# EAGLE design mass_measurement (EAGLE 9.6.2)
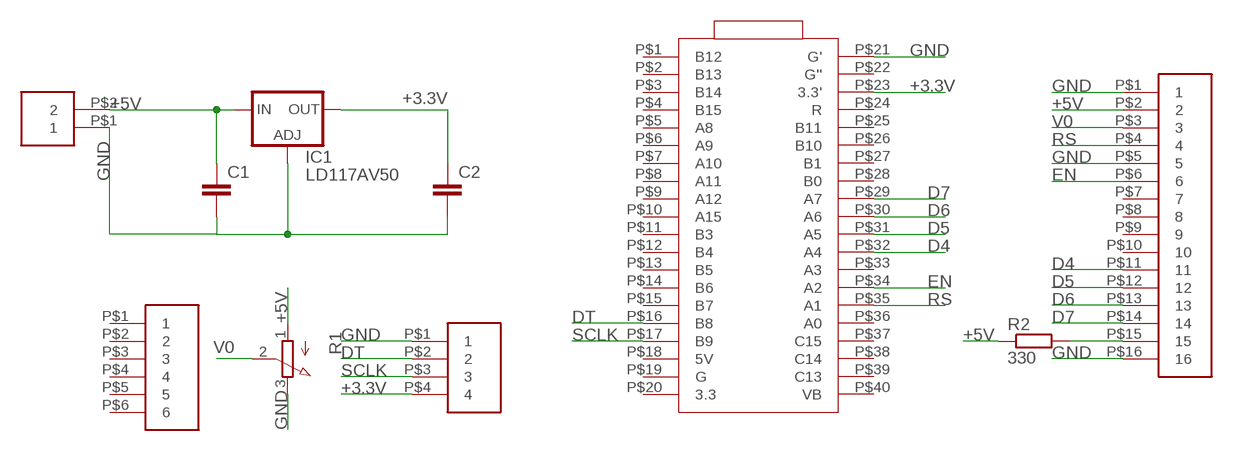
[diagram p0: schematic, sheet 1]

## Parts
C1  C-EU025-030X050  [C025-030X050]
C2  C-EU025-030X050  [C025-030X050]
IC1  LD117AV50  [TO220L1]
R1  3RP/1610N  [3RP/1610N]
R2  330  R-EU_0617/17  [0617/17]
U$1  HEADER_2  [HEADER_2_FOOT]
U$2  HEADER_16  [HEADER_16_FOOT]
U$3  BLUE_PILL_EA  [BLUE_PILL_FOOT]
U$4  HEADER_4  [HEADER_4_FOOT]
U$5  HEADER_6  [HEADER_6_FOOT]

## Nets
+3.3V: C2.1 IC1.2(OUT) U$3.P$23(3.3') U$4.P$4
+5V: C1.1 IC1.3(IN) R1.1(A) R2.1 U$1.P$2 U$2.P$2
D4: U$2.P$11 U$3.P$32(A4)
D5: U$2.P$12 U$3.P$31(A5)
D6: U$2.P$13 U$3.P$30(A6)
D7: U$2.P$14 U$3.P$29(A7)
DT: U$3.P$16(B8) U$4.P$2
EN: U$2.P$6 U$3.P$34(A2)
GND: C1.2 C2.2 IC1.1(ADJ) R1.3(E) U$1.P$1 U$2.P$1 U$2.P$5 U$2.P$16 U$3.P$21(G') U$4.P$1
N$1: R2.2 U$2.P$15
RS: U$2.P$4 U$3.P$35(A1)
SCLK: U$3.P$17(B9) U$4.P$3
V0: R1.2(S) U$2.P$3
Unconnected: U$2.P$7 U$2.P$8 U$2.P$9 U$2.P$10 U$3.P$1(B12) U$3.P$2(B13) U$3.P$3(B14) U$3.P$4(B15) U$3.P$5(A8) U$3.P$6(A9) U$3.P$7(A10) U$3.P$8(A11) U$3.P$9(A12) U$3.P$10(A15) U$3.P$11(B3) U$3.P$12(B4) U$3.P$13(B5) U$3.P$14(B6) U$3.P$15(B7) U$3.P$18(5V) U$3.P$19(G) U$3.P$20(3.3) U$3.P$22(G'') U$3.P$24(R) U$3.P$25(B11) U$3.P$26(B10) U$3.P$27(B1) U$3.P$28(B0) U$3.P$33(A3) U$3.P$36(A0) U$3.P$37(C15) U$3.P$38(C14) U$3.P$39(C13) U$3.P$40(VB) U$5.P$1 U$5.P$2 U$5.P$3 U$5.P$4 U$5.P$5 U$5.P$6

## Library data of the parts
C1 C2 = rcl:C-EU: CAPACITOR, European symbol; SPICEPREFIX: C
IC1 = v-reg:LD117A?*: Low drop fixed and adjustable positive voltage regulators 1 A Source: http://www.st.com/stonline/products/literature/ds/7194/ld1117axx.pdf
R1 = pot:3RP/1610N: 16mm Potentiometer one level Source: http://www.alphapotentiometers.net/html/16mm_pot_2.html
R2 = rcl:R-EU_: RESISTOR, European symbol; SPICEPREFIX: R
U$1 = header:HEADER_2
U$2 = header:HEADER_16
U$3 = blue_pill_ea:BLUE_PILL_EA
U$4 = header:HEADER_4
U$5 = header:HEADER_6

## Board
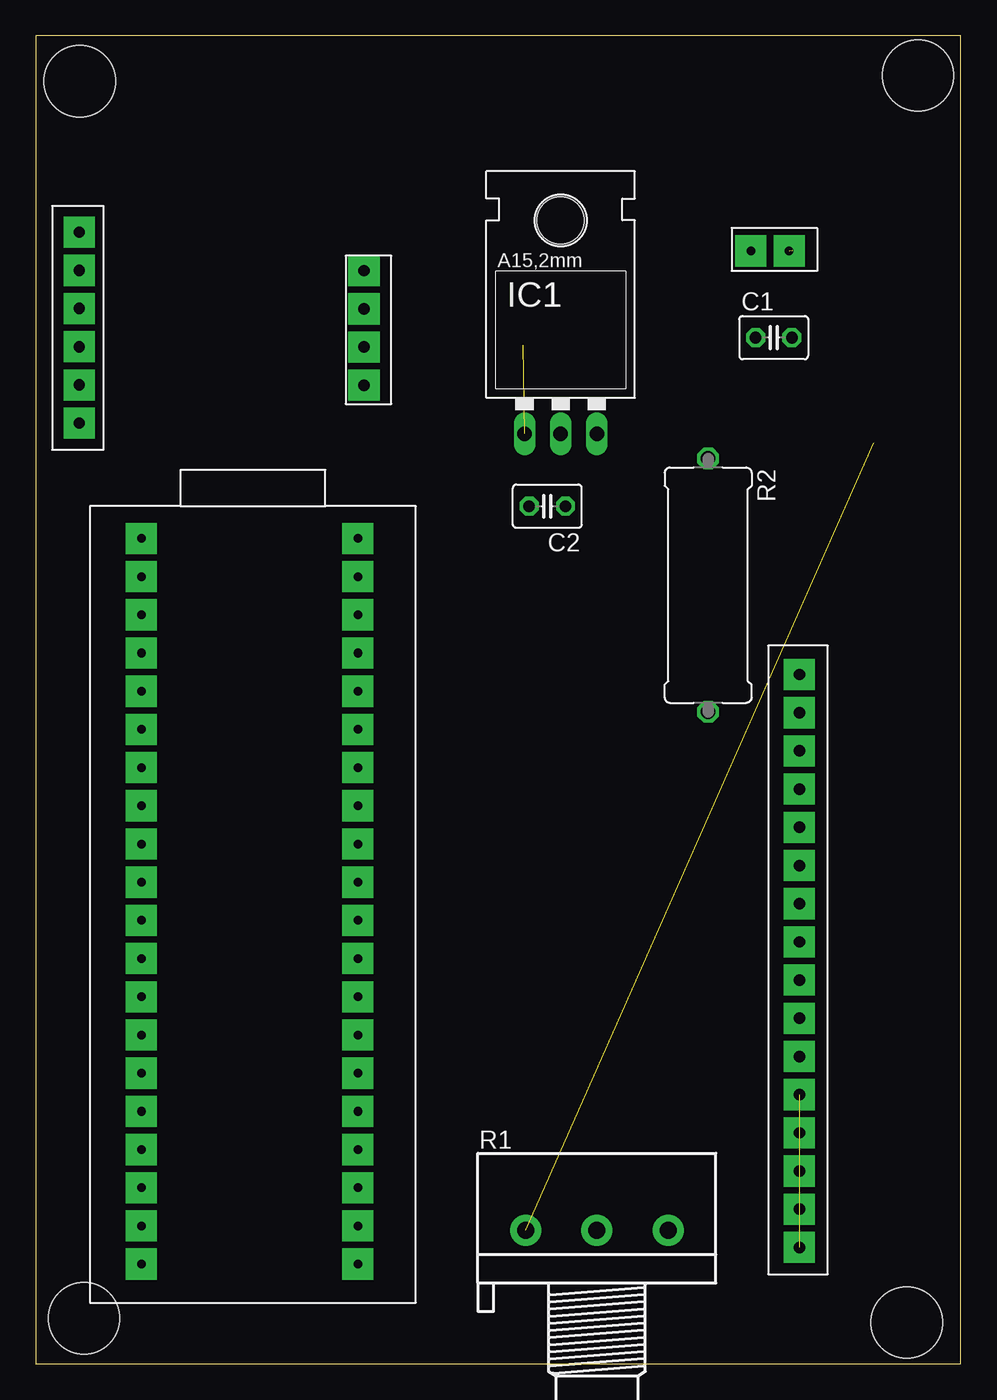
[diagram p1: board, top side]
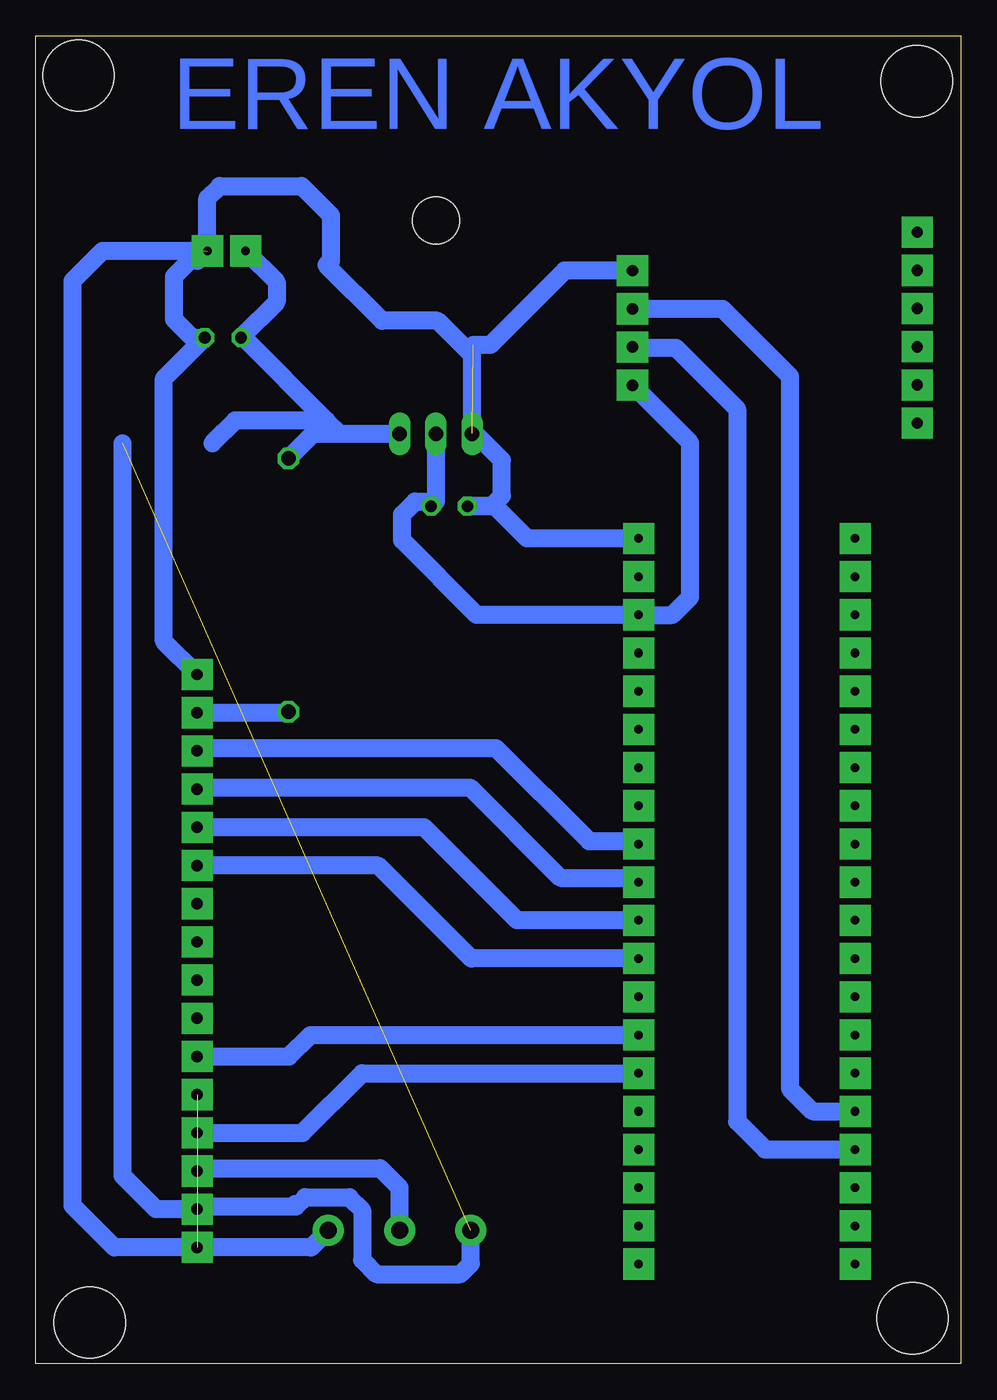
[diagram p2: board, bottom side, seen from below]

Size 64.9 x 93.2 mm. Coordinates in mm from the lower left corner, seen from the top.
Outline: 0,0 64.9,0 64.9,93.2 0,93.2 0,0
Copper layers (1*16): Top 0.035mm / dielectric 1.5mm / Bottom 0.035mm
Design rules "default": minimum track width 6mil, minimum drill 0.35mm, track to track 6mil, track to pad 6mil, pad to pad 6mil, via to via 6mil, smd to smd 6mil, copper to edge 40mil, drill to drill 6mil, minimum pad ring 10mil, minimum via ring 8mil, stop-mask expansion 4mil, vias tented up to drill 0mil, thermal gap 10mil
Holes 5 mm at 61.1,2.9 3.4,3.2 3.1,90 61.9,90.4

### Footprints (pad centres in the part's own frame; a part is rotated, then mirrored left to right if it is on the bottom)
C025-030X050 = drill 0.813 octagon: 1 -1.27,0; 2 1.27,0
TO220L1 = drill 1.016 long: 1 -2.54,-3.81; 2 0,-3.81; 3 2.54,-3.81 | hole 3.302: 0,11.176
3RP/1610N = drill 1.2 pad 2.184: 1 -5,0; 2 0,0; 3 5,0
0617/17 = drill 1.016 octagon: 1 -8.89,0; 2 8.89,0
HEADER_2_FOOT = drill 0.6 pad 2.184 square: P$1 -0.4,-0.96; P$2 -0.4,-3.64
HEADER_16_FOOT = drill 0.8 pad 2.184 square: P$1 -1.5,17.72; P$2 -1.5,15.04; P$3 -1.5,12.36; P$4 -1.5,9.68; P$5 -1.5,7; P$6 -1.5,4.32; P$7 -1.5,1.64; P$8 -1.5,-1.04; P$9 -1.5,-3.72; P$10 -1.5,-6.4; P$11 -1.5,-9.08; P$12 -1.5,-11.76; P$13 -1.5,-14.44; P$14 -1.5,-17.12; P$15 -1.5,-19.8; P$16 -1.5,-22.48
BLUE_PILL_FOOT = drill 0.6 pad 2.184 square: P$1 -7.82,21.87; P$2 -7.82,19.19; P$3 -7.82,16.51; P$4 -7.82,13.83; P$5 -7.82,11.15; P$6 -7.82,8.47; P$7 -7.82,5.79; P$8 -7.82,3.11; P$9 -7.82,0.43; P$10 -7.82,-2.25; P$11 -7.82,-4.93; P$12 -7.82,-7.61; P$13 -7.82,-10.29; P$14 -7.82,-12.97; P$15 -7.82,-15.65; P$16 -7.82,-18.33; P$17 -7.82,-21.01; P$18 -7.82,-23.69; P$19 -7.82,-26.37; P$20 -7.82,-29.05; P$21 7.36,21.87; P$22 7.36,19.19; P$23 7.36,16.51; P$24 7.36,13.83; P$25 7.36,11.15; P$26 7.36,8.47; P$27 7.36,5.79; P$28 7.36,3.11; P$29 7.36,0.43; P$30 7.36,-2.25; P$31 7.36,-4.93; P$32 7.36,-7.61; P$33 7.36,-10.29; P$34 7.36,-12.97; P$35 7.36,-15.65; P$36 7.36,-18.33; P$37 7.36,-21.01; P$38 7.36,-23.69; P$39 7.36,-26.37; P$40 7.36,-29.05
HEADER_4_FOOT = drill 0.8 pad 2.184 square: P$1 -1.12,3.76; P$2 -1.12,1.08; P$3 -1.12,-1.6; P$4 -1.12,-4.28
HEADER_6_FOOT = drill 0.8 pad 2.184 square: P$1 -0.8,6.26; P$2 -0.8,3.58; P$3 -0.8,0.9; P$4 -0.8,-1.78; P$5 -0.8,-4.46; P$6 -0.8,-7.14

### Placement (x,y rotation side)
C1  51.77,72.01 0 top
C2  35.89,60.18 180 top
IC1  36.83,69.07 0 top
R1  39.37,9.38 0 top
R2  47.17,54.64 270 top
U$1  53.81,77.69 270 top
U$2  52.07,25.89 180 top
U$3  15.24,36.05 0 top
U$4  24.15,72.95 0 top
U$5  3.86,73.15 0 top

### Tracks (layer width: path | path; a pad name or v marks a point on that pad's centre or on a via)
+3.3V
  Bottom 1.27: U$4.P$4 19,64.64 19,53.8 20.24,52.56 U$3.P$23 33.96,52.56 39.2,57.8 39.2,59.6 38.29,60.51 36.83,60.51 | IC1.2 36.83,60.51 | 36.83,60.51 C2.1
+5V  (1 unrouted)
  Bottom 1.27: U$1.P$2 48,75.92 48,74.51 C1.1 50.31,72.01 44.5,66.2 | 44.5,66.2 43.56,65.26 IC1.3 45.44,65.26 R2.1 | 46.85,11.05 53.37,11.05 U$2.P$2 56.45,10.85 58.8,13.2 58.8,64.6 | 46.7,11.2 46.85,11.05 | 46.85,11.05 46.65,11.05 46,11.7 42.9,11.7 42,10.8 42,7.3 41,6.3 35.1,6.3 34.37,7.03 R1.1 | 44.5,66.2 50.9,66.2 52.5,64.6
D4
  Bottom 1.27: U$3.P$32 34.34,28.44 40.87,34.97 U$2.P$11
D5
  Bottom 1.27: U$3.P$31 31.12,31.12 37.65,37.65 U$2.P$12
D6
  Bottom 1.27: U$2.P$13 53.47,40.43 34.43,40.43 28.1,34.1 22.9,34.1 U$3.P$30
D7
  Bottom 1.27: U$3.P$29 22.8,36.68 26.08,36.68 32.61,43.21 53.37,43.21 U$2.P$14
DT
  Bottom 1.27: U$4.P$2 16.73,74.03 12,69.3 12,19.3 10.42,17.72 U$3.P$16
EN
  Bottom 1.27: U$2.P$6 47.13,21.57 45.62,23.08 U$3.P$34
GND  (3 unrouted)
  Bottom 1.27: U$4.P$1 27.79,76.71 33,71.5 34.2,71.5 | U$3.P$21 30.42,57.92 32.68,60.18 C2.2 32.92,60.18 32.2,60.9 32.2,63.4 34.06,65.26 IC1.1 34.29,70.79 36.7,73.2 40.6,73.2 44.5,77.1 44.2,77.4 44.2,80.6 46.25,82.65 52,82.65 52.85,81.8 U$1.P$1 53.54,77.4 54.1,77.4 55.2,76.3 55.2,73.3 53.91,72.01 C1.2 55.9,69.15 55.9,50.7 U$2.P$16 | R1.3 45.58,8.17 U$2.P$1 59.37,8.17 62.3,11.1 62.3,76 60.2,78.1 53.1,78.1
N$1
  Bottom 1.27: U$2.P$15 47.23,45.69 R2.2
RS
  Bottom 1.27: U$2.P$4 46.19,16.21 42,20.4 U$3.P$35
SCLK
  Bottom 1.27: U$4.P$3 22.98,71.3 20,71.3 15.7,67 15.7,17 13.74,15.04 U$3.P$17
V0
  Bottom 1.27: R1.2 39.37,12.37 40.73,13.73 53.37,13.73 U$2.P$3

### Text on the board
Bottom: EREN AKYOL